# EAGLE design ArduPilotMega_v141 (EAGLE 5.10)
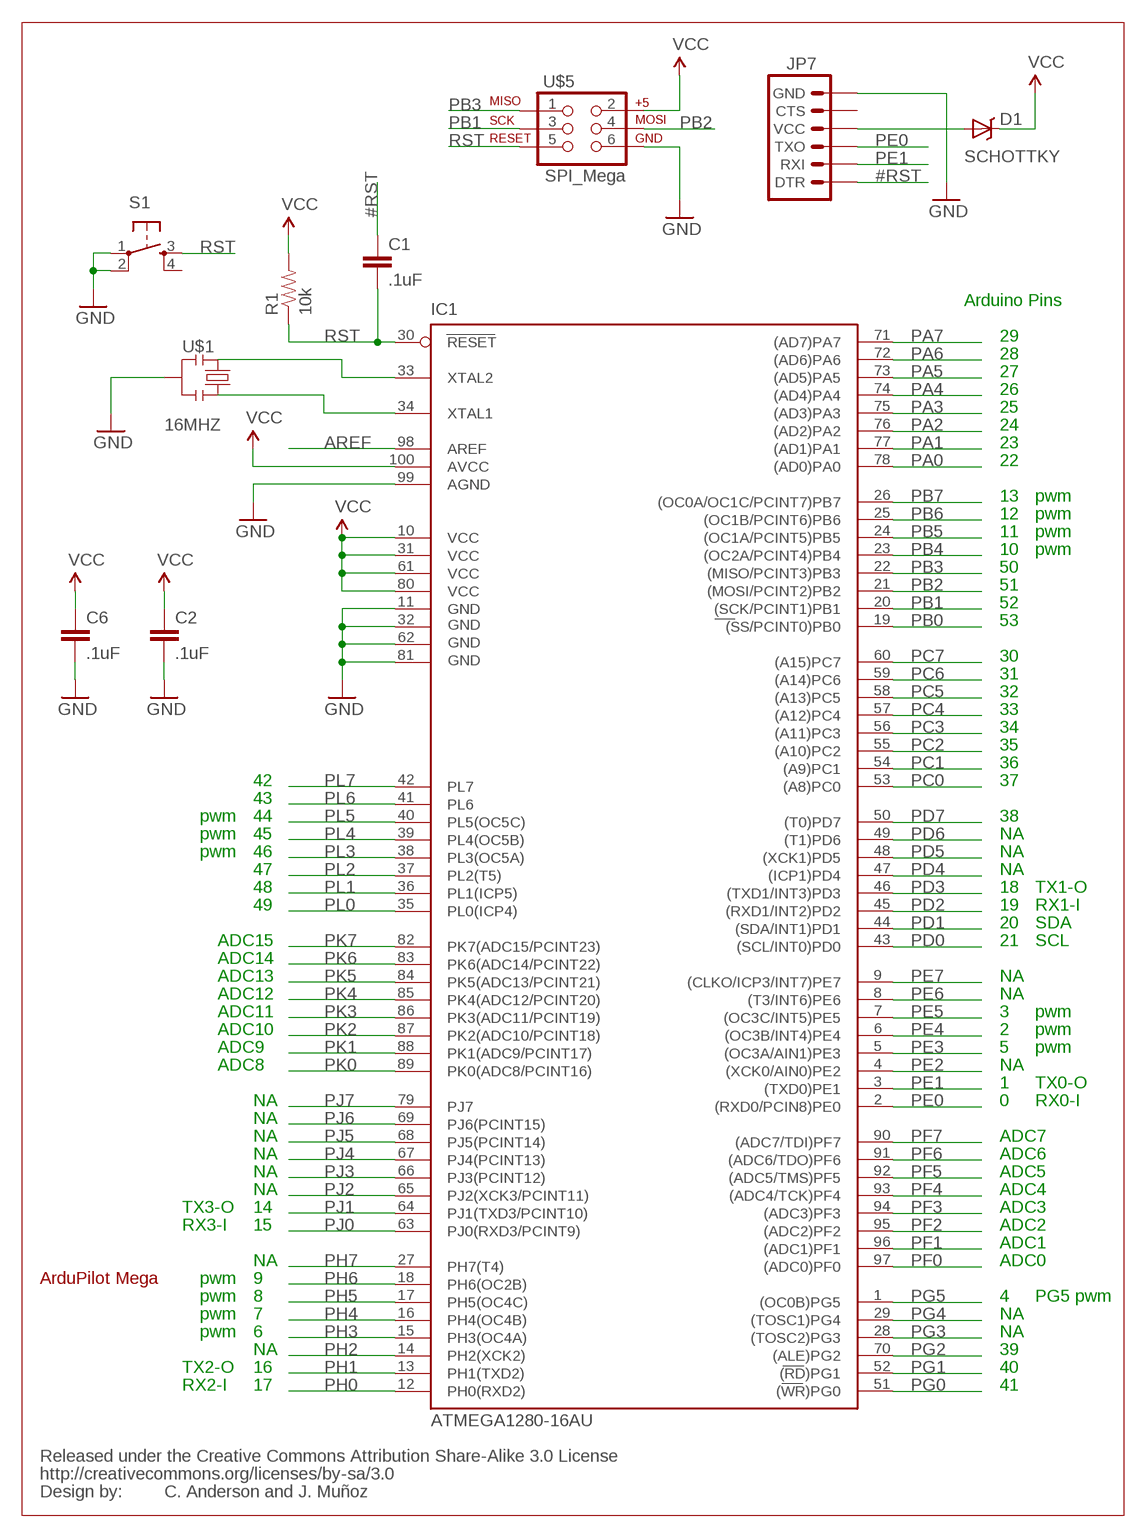
[diagram p0: schematic, sheet 1, part 1 of 2]
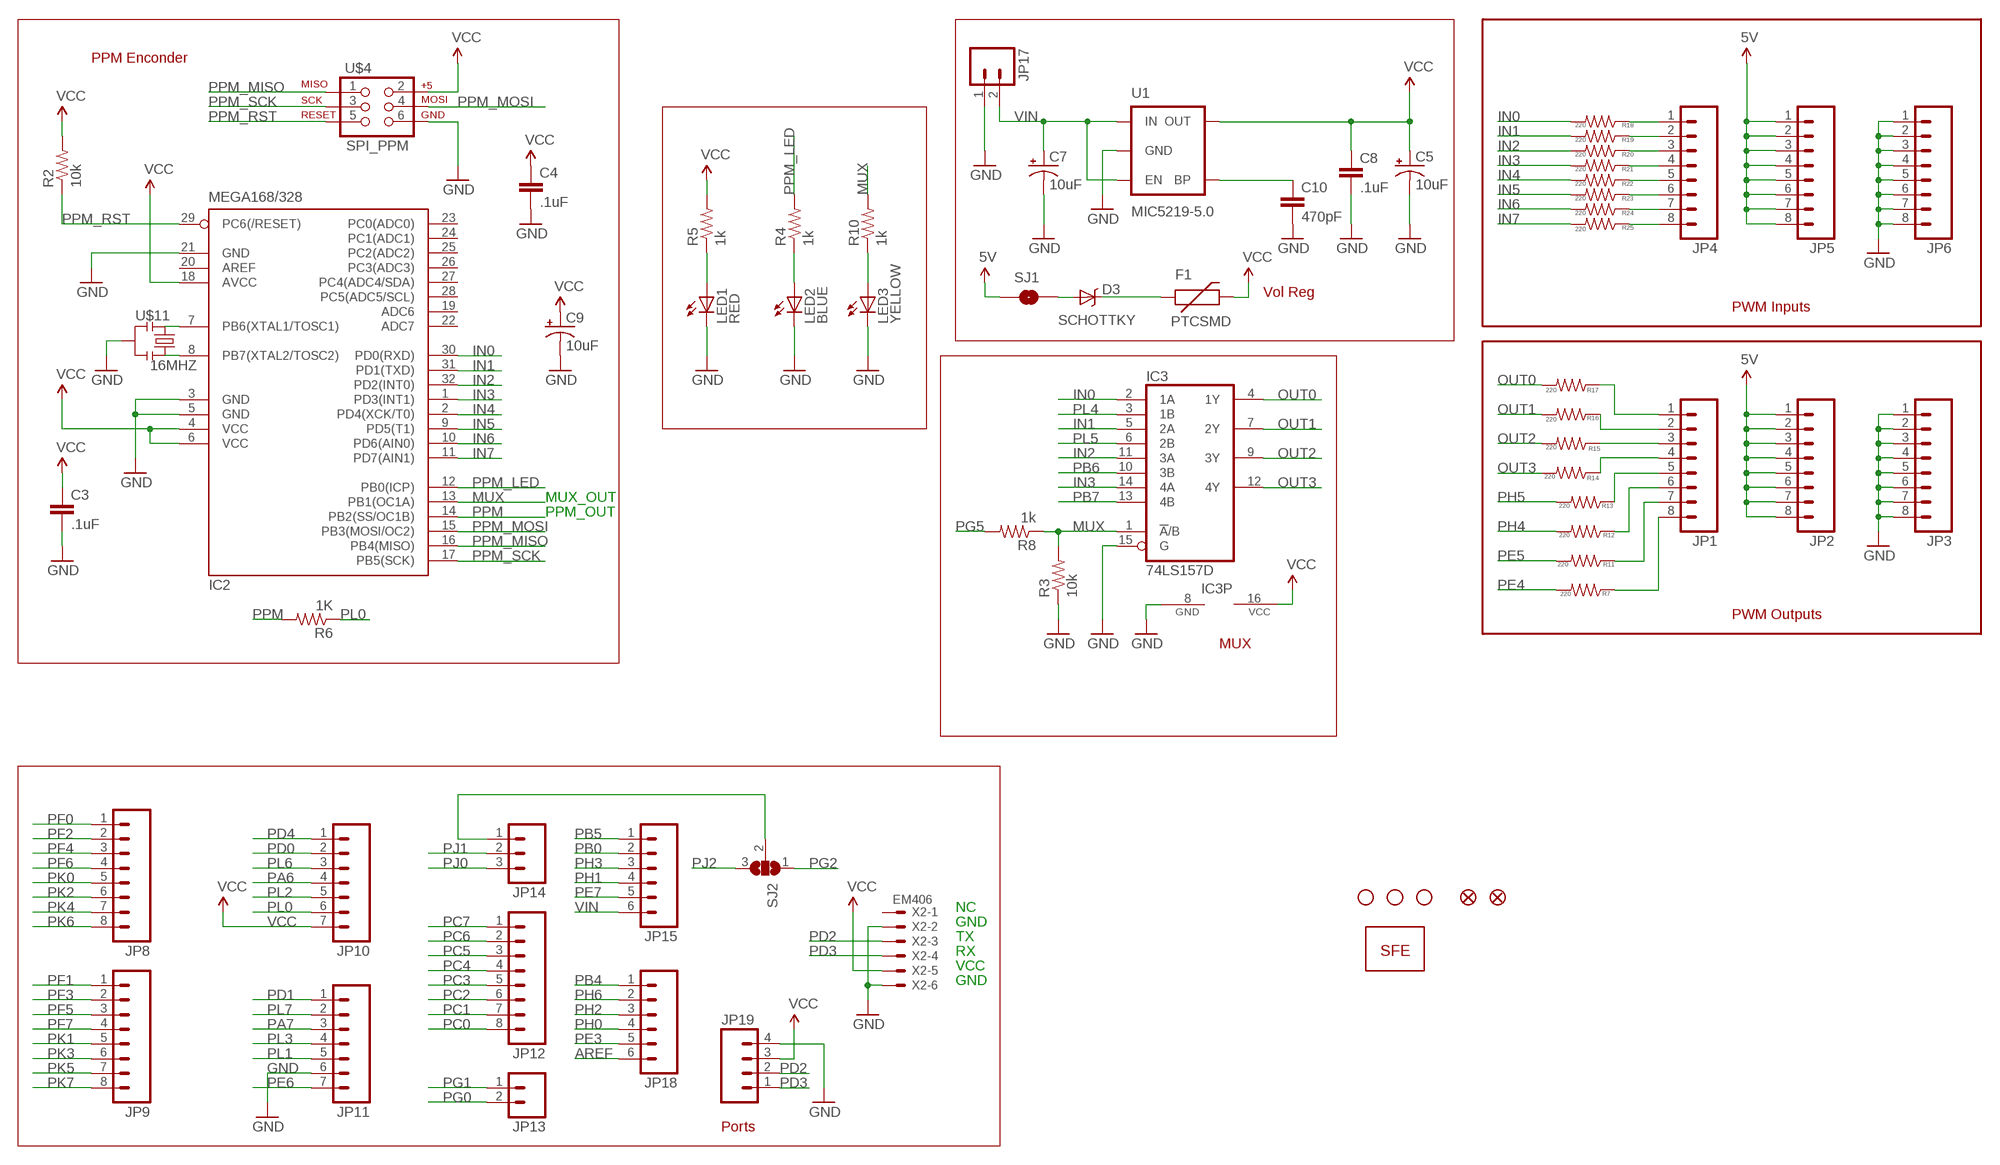
[diagram p1: schematic, sheet 1, part 2 of 2]

## Parts
C1  .1uF  CAP0402  [C0402]
C2  .1uF  CAP0402  [C0402]
C3  .1uF  CAP0402  [C0402]
C4  .1uF  CAP0402  [C0402]
C5  10uF  CAP_POL1206  [EIA3216]
C6  .1uF  CAP0402  [C0402]
C7  10uF  CAP_POL1206  [EIA3216]
C8  .1uF  CAP0402  [C0402]
C9  10uF  CAP_POL1206  [EIA3216]
C10  470pF  CAP0402  [C0402]
D1  SCHOTTKY  DIODE-SCHOTTKY_  [SMA-DIODE]
D3  SCHOTTKY  DIODE-SCHOTTKY_  [SMA-DIODE]
F1  PTCSMD  [PTC-1206]
IC1  ATMEGA1280-16AU  [TQFP100]
IC2  MEGA168/328  MEGA8-AI  [TQFP32-08]
IC3  74LS157D  [SO16]
JP1  M08  [1X08]
JP2  M08  [1X08]
JP3  M08  [1X08]
JP4  M08  [1X08]
JP5  M08  [1X08]
JP6  M08  [1X08]
JP7  ARDUINO_SERIAL_PROGRAMPTH  [1X06]
JP8  M08  [1X08]
JP9  M08  [1X08]
JP10  M07  [1X07]
JP11  M07  [1X07]
JP12  M08  [1X08]
JP13  M02PTH  [1X02]
JP14  M03PTH  [1X03]
JP15  M06SIP  [1X06]
JP16  FIDUCIAL1X2  [FIDUCIAL-1X2]
JP17  M02NG  [1X02]
JP18  M06SIP  [1X06]
JP19  M04PTH  [1X04]
JP20  FIDUCIAL1X2  [FIDUCIAL-1X2]
LED1  RED  LED0603  [LED-0603]
LED2  BLUE  LED0603  [LED-0603]
LED3  YELLOW  LED0603  [LED-0603]
R1  10k  RESISTOR0402  [C0402]
R2  10k  RESISTOR0402  [C0402]
R3  10k  RESISTOR0402  [C0402]
R4  1k  RESISTOR0402  [C0402]
R5  1k  RESISTOR0402  [C0402]
R6  1K  RESISTOR0402  [C0402]
R7  220  RESISTOR0402  [C0402]
R8  1k  RESISTOR0402  [C0402]
R10  1k  RESISTOR0402  [C0402]
R11  220  RESISTOR0402  [C0402]
R12  220  RESISTOR0402  [C0402]
R13  220  RESISTOR0402  [C0402]
R14  220  RESISTOR0402  [C0402]
R15  220  RESISTOR0402  [C0402]
R16  220  RESISTOR0402  [C0402]
R17  220  RESISTOR0402  [C0402]
R18  220  RESISTOR0402  [C0402]
R19  220  RESISTOR0402  [C0402]
R20  220  RESISTOR0402  [C0402]
R21  220  RESISTOR0402  [C0402]
R22  220  RESISTOR0402  [C0402]
R23  220  RESISTOR0402  [C0402]
R24  220  RESISTOR0402  [C0402]
R25  220  RESISTOR0402  [C0402]
S1  TAC_SWITCHSMD  [TACTILE_SWITCH_SMD]
SJ1  SJ2  SOLDERJUMPERNC  [SJ_2S]
SJ2  SOLDERJUMPER_2WAYS  [SJ_3]
U1  MIC5219-5.0  V_REG_LDOSMD  [SOT23-5]
U$1  16MHZ  RESONATORSMD  [RESONATOR-SMD]
U$4  SPI_PPM  AVR_SPI_PRG_6NS  [2X3-NS]
U$5  SPI_Mega  AVR_SPI_PRG_6NS  [2X3-NS]
U$7  LOGO-SFENEW  [SFE-NEW-WEBLOGO]
U$8  CREATIVE_COMMONS  [CREATIVE_COMMONS]
U$10  STAND-OFF  [STAND-OFF]
U$11  16MHZ  RESONATORSMD  [RESONATOR-SMD]
U$12  STAND-OFF  [STAND-OFF]
U$13  STAND-OFF  [STAND-OFF]
X2  EM406  SM06B-SRSS-TB  [SM06B-SRSS-TB]

## Nets
5V: JP2.1 JP2.2 JP2.3 JP2.4 JP2.5 JP2.6 JP2.7 JP2.8 JP5.1 JP5.2 JP5.3 JP5.4 JP5.5 JP5.6 JP5.7 JP5.8 SJ1.1
#RST: C1.1 JP7.1(DTR)
AREF: IC1.98(AREF) JP18.6
GND: C2.2 C3.2 C4.2 C5.C(-) C6.2 C7.C(-) C8.2 C9.C(-) C10.2 IC1.11(GND) IC1.32(GND1) IC1.62(GND2) IC1.81(GND3) IC1.99(AGND) IC2.3(GND) IC2.5(GND) IC2.21(GND) IC3.8(GND) IC3.15(G) JP3.1 JP3.2 JP3.3 JP3.4 JP3.5 JP3.6 JP3.7 JP3.8 JP6.1 JP6.2 JP6.3 JP6.4 JP6.5 JP6.6 JP6.7 JP6.8 JP7.6(GND) JP11.6 JP17.1 JP19.4 LED1.C LED2.C LED3.C R3.1 S1.1 S1.2 U1.2(GND) U$1.2 U$4.6 U$5.6 U$11.2 X2.2 X2.6
IN0: IC2.30(PD0(RXD)) IC3.2(1A) R18.2
IN1: IC2.31(PD1(TXD)) IC3.5(2A) R19.2
IN2: IC2.32(PD2(INT0)) IC3.11(3A) R20.2
IN3: IC2.1(PD3(INT1)) IC3.14(4A) R21.2
IN4: IC2.2(PD4(XCK/T0)) R22.2
IN5: IC2.9(PD5(T1)) R23.2
IN6: IC2.10(PD6(AIN0)) R24.2
IN7: IC2.11(PD7(AIN1)) R25.2
MUX: IC2.13(PB1(OC1A)) IC3.1(!A!/B) R3.2 R8.1 R10.2
N$1: LED1.A R5.1
N$2: LED2.A R4.1
N$3: C10.1 U1.4(BP)
N$5: LED3.A R10.1
N$6: IC2.7(PB6(XTAL1/TOSC1)) U$11.1
N$7: IC2.8(PB7(XTAL2/TOSC2)) U$11.3
N$8: JP1.5 R13.1
N$9: JP1.6 R12.1
N$10: JP1.7 R11.1
N$11: JP1.8 R7.1
N$12: JP14.1 SJ2.2
N$13: JP1.4 R14.1
N$14: JP1.3 R15.1
N$15: JP1.2 R16.1
N$16: JP1.1 R17.1
N$17: D3.A SJ1.2
N$18: JP4.1 R18.1
N$19: JP4.2 R19.1
N$20: JP4.3 R20.1
N$21: JP4.4 R21.1
N$22: JP4.5 R22.1
N$23: JP4.6 R23.1
N$24: JP4.7 R24.1
N$25: JP4.8 R25.1
N$26: D3.C F1.1
N$27: D1.A JP7.4(VCC)
N$56: IC1.34(XTAL1) U$1.3
N$89: IC1.33(XTAL2) U$1.1
OUT0: IC3.4(1Y) R17.2
OUT1: IC3.7(2Y) R16.2
OUT2: IC3.9(3Y) R15.2
OUT3: IC3.12(4Y) R14.2
PA0: IC1.78((AD0)PA0)
PA1: IC1.77((AD1)PA1)
PA2: IC1.76((AD2)PA2)
PA3: IC1.75((AD3)PA3)
PA4: IC1.74((AD4)PA4)
PA5: IC1.73((AD5)PA5)
PA6: IC1.72((AD6)PA6) JP10.4
PA7: IC1.71((AD7)PA7) JP11.3
PB0: IC1.19((SS/PCINT0)PB0) JP15.2
PB1: IC1.20((SCK/PCINT1)PB1) U$5.3
PB2: IC1.21((MOSI/PCINT2)PB2) U$5.4
PB3: IC1.22((MISO/PCINT3)PB3) U$5.1
PB4: IC1.23((OC2A/PCINT4)PB4) JP18.1
PB5: IC1.24((OC1A/PCINT5)PB5) JP15.1
PB6: IC1.25((OC1B/PCINT6)PB6) IC3.10(3B)
PB7: IC1.26((OC0A/OC1C/PCINT7)PB7) IC3.13(4B)
PC0: IC1.53((A8)PC0) JP12.8
PC1: IC1.54((A9)PC1) JP12.7
PC2: IC1.55((A10)PC2) JP12.6
PC3: IC1.56((A11)PC3) JP12.5
PC4: IC1.57((A12)PC4) JP12.4
PC5: IC1.58((A13)PC5) JP12.3
PC6: IC1.59((A14)PC6) JP12.2
PC7: IC1.60((A15)PC7) JP12.1
PD0: IC1.43((SCL/INT0)PD0) JP10.2
PD1: IC1.44((SDA/INT1)PD1) JP11.1
PD2: IC1.45((RXD1/INT2)PD2) JP19.2 X2.3
PD3: IC1.46((TXD1/INT3)PD3) JP19.1 X2.4
PD4: IC1.47((ICP1)PD4) JP10.1
PD5: IC1.48((XCK1)PD5)
PD6: IC1.49((T1)PD6)
PD7: IC1.50((T0)PD7)
PE0: IC1.2((RXD0/PCIN8)PE0) JP7.3(TXO)
PE1: IC1.3((TXD0)PE1) JP7.2(RXI)
PE2: IC1.4((XCK0/AIN0)PE2)
PE3: IC1.5((OC3A/AIN1)PE3) JP18.5
PE4: IC1.6((OC3B/INT4)PE4) R7.2
PE5: IC1.7((OC3C/INT5)PE5) R11.2
PE6: IC1.8((T3/INT6)PE6) JP11.7
PE7: IC1.9((CLKO/ICP3/INT7)PE7) JP15.5
PF0: IC1.97((ADC0)PF0) JP8.1
PF1: IC1.96((ADC1)PF1) JP9.1
PF2: IC1.95((ADC2)PF2) JP8.2
PF3: IC1.94((ADC3)PF3) JP9.2
PF4: IC1.93((ADC4/TCK)PF4) JP8.3
PF5: IC1.92((ADC5/TMS)PF5) JP9.3
PF6: IC1.91((ADC6/TDO)PF6) JP8.4
PF7: IC1.90((ADC7/TDI)PF7) JP9.4
PG0: IC1.51((WR)PG0) JP13.2
PG1: IC1.52((RD)PG1) JP13.1
PG2: IC1.70((ALE)PG2) SJ2.1
PG3: IC1.28((TOSC2)PG3)
PG4: IC1.29((TOSC1)PG4)
PG5: IC1.1((OC0B)PG5) R8.2
PH0: IC1.12(PH0(RXD2)) JP18.4
PH1: IC1.13(PH1(TXD2)) JP15.4
PH2: IC1.14(PH2(XCK2)) JP18.3
PH3: IC1.15(PH3(OC4A)) JP15.3
PH4: IC1.16(PH4(OC4B)) R12.2
PH5: IC1.17(PH5(OC4C)) R13.2
PH6: IC1.18(PH6(OC2B)) JP18.2
PH7: IC1.27(PH7(T4))
PJ0: IC1.63(PJ0(RXD3/PCINT9)) JP14.3
PJ1: IC1.64(PJ1(TXD3/PCINT10)) JP14.2
PJ2: IC1.65(PJ2(XCK3/PCINT11)) SJ2.3
PJ3: IC1.66(PJ3(PCINT12))
PJ4: IC1.67(PJ4(PCINT13))
PJ5: IC1.68(PJ5(PCINT14))
PJ6: IC1.69(PJ6(PCINT15))
PJ7: IC1.79(PJ7)
PK0: IC1.89(PK0(ADC8/PCINT16)) JP8.5
PK1: IC1.88(PK1(ADC9/PCINT17)) JP9.5
PK2: IC1.87(PK2(ADC10/PCINT18)) JP8.6
PK3: IC1.86(PK3(ADC11/PCINT19)) JP9.6
PK4: IC1.85(PK4(ADC12/PCINT20)) JP8.7
PK5: IC1.84(PK5(ADC13/PCINT21)) JP9.7
PK6: IC1.83(PK6(ADC14/PCINT22)) JP8.8
PK7: IC1.82(PK7(ADC15/PCINT23)) JP9.8
PL0: IC1.35(PL0(ICP4)) JP10.6 R6.1
PL1: IC1.36(PL1(ICP5)) JP11.5
PL2: IC1.37(PL2(T5)) JP10.5
PL3: IC1.38(PL3(OC5A)) JP11.4
PL4: IC1.39(PL4(OC5B)) IC3.3(1B)
PL5: IC1.40(PL5(OC5C)) IC3.6(2B)
PL6: IC1.41(PL6) JP10.3
PL7: IC1.42(PL7) JP11.2
PPM: IC2.14(PB2(SS/OC1B)) R6.2
PPM_LED: IC2.12(PB0(ICP)) R4.2
PPM_MISO: IC2.16(PB4(MISO)) U$4.1
PPM_MOSI: IC2.15(PB3(MOSI/OC2)) U$4.4
PPM_RST: IC2.29(PC6(/RESET)) R2.1 U$4.5
PPM_SCK: IC2.17(PB5(SCK)) U$4.3
RST: C1.2 IC1.30(RESET) R1.1 S1.3 U$5.5
VCC: C2.1 C3.1 C4.1 C5.A(+) C6.1 C8.1 C9.A(+) D1.C F1.2 IC1.10(VCC) IC1.31(VCC1) IC1.61(VCC2) IC1.80(VCC3) IC1.100(AVCC) IC2.4(VCC) IC2.6(VCC) IC2.18(AVCC) IC3.16(VCC) JP10.7 JP19.3 R1.2 R2.2 R5.2 U1.5(OUT) U$4.2 U$5.2 X2.5
VIN: C7.A(+) JP15.6 JP17.2 U1.1(IN) U1.3(EN)
Unconnected: IC2.19(ADC6) IC2.20(AREF) IC2.22(ADC7) IC2.23(PC0(ADC0)) IC2.24(PC1(ADC1)) IC2.25(PC2(ADC2)) IC2.26(PC3(ADC3)) IC2.27(PC4(ADC4/SDA)) IC2.28(PC5(ADC5/SCL)) JP7.5(CTS) S1.4 X2.1

## Notes on the sheet
- PPM Enconder
- Arduino Pins
- 29
- 28 | Vol Reg
- 27 | PWM Inputs
- 26
- 25
- 24
- 23
- 22
- 13 | pwm
- 12 | pwm
- 11 | pwm
- 10 | pwm
- 50
- 51
- 52 | MUX_OUT
- 53 | PPM_OUT
- 30
- 31
- 32
- 33
- 34
- 35 | PWM Outputs
- 36
- 42 | 37 | MUX
- 43
- pwm | 44 | 38
- pwm | 45 | NA
- pwm | 46 | NA
- 47 | NA
- 48 | 18 | TX1-O
- 49 | 19 | RX1-I
- 20 | SDA
- ADC15 | 21 | SCL
- ADC14
- ADC13 | NA
- ADC12 | NA
- ADC11 | 3 | pwm
- ADC10 | 2 | pwm
- ADC9 | 5 | pwm
- ADC8 | NA
- 1 | TX0-O
- NA | 0 | RX0-I | NC
- NA | GND
- NA | ADC7 | TX
- NA | ADC6 | RX
- NA | ADC5 | VCC
- NA | ADC4 | GND
- TX3-O | 14 | ADC3
- RX3-I | 15 | ADC2
- ADC1
- NA | ADC0
- ArduPilot Mega | pwm | 9
- pwm | 8 | 4 | PG5 pwm
- pwm | 7 | NA
- pwm | 6 | NA
- NA | 39
- TX2-O | 16 | 40 | Ports
- RX2-I | 17 | 41
- C. Anderson and J. Muñoz

## Library data of the parts
C1-C4 C6 C8 C10 = DIYdrones3:CAP: Capacitor Standard 0603 ceramic capacitor, and 0.1" leaded capacitor.
C5 C7 C9 = DIYdrones3:CAP_POL: Capacitor Polarized These are standard SMD and PTH capacitors. Normally 10uF, 47uF, and 100uF in electrolytic and tantalum varieties. Always verify the external diameter of the through hole cap, it varies with capacity, voltage, and manufacturer. The EIA devices should be standard.
D1 D3 = SparkFun:DIODE-SCHOTTKY
F1 = SparkFun:PTC: Resettable Fuse PTC Resettable Fuse. Spark Fun Electronics SKU : COM-08357
IC1 = atmel-2010:ATMEGA*: MICROCONTROLLER 64/128/256 Kbytes FLASH 4 Kbytes EEPROM 8 Kbytes SRAM 86 General Purpose I/O pins 12-channels16-bit PWM 4 x Serial USARTs 16-channels 10-bit A/D
IC2 = atmel:MEGA8: MICROCONTROLLER 8 Kbytes FLASH, 1 kbytes SRAM, 512 bytes EEPROM, USART, 6-channel 10 bit ADC, 2-channel 8 bit ADC Pin compatible with Atmega48, ATMega88, ATMega168 Source: avr.lbr
IC3 = 74xx-us:74*157: Quadruple 2-line to 1-line data SELECTOR/MULTIPLEXER
JP1-JP6 JP8 JP9 JP12 = SparkFunv2:M08: Header 8 Standard 8-pin 0.1" header. Use with straight break away headers (SKU : PRT-00116), right angle break away headers (PRT-00553), swiss pins (PRT-00743), machine pins (PRT-00117), and female headers (PRT-00115).
JP7 = SparkFunv2:ARDUINO_SERIAL_PROGRAM
JP10 JP11 = SparkFunv2:M07: Header 7 Standard 7-pin 0.1" header. Use with straight break away headers (SKU : PRT-00116), right angle break away headers (PRT-00553), swiss pins (PRT-00743), machine pins (PRT-00117), and female headers (PRT-00115). NOTES ON THE VARIANTS LOCK and LOCK_LONGPADS... This footprint was designed to help hold the alignment of a through-hole component (i.e. 7-pin header) while soldering it into place. You may notice that each hole has been shifted either up or down by 0.005 of an inch from it's more standard position (which is usually a perfectly straight line). This slight alteration caused the pins (the squares in the middle) to touch the edges of the holes. Because they are alternating, it causes a "brace" to hold the header in place. 0.005 has proven to be the perfect amount of "off-center" position when using our standard breakaway headers. Although looks a little odd when you look at the bare footprint, once you have a header in there, the alteration is very hard to notice. Also, if you push a header all the way into place, it is covered up entirely on the bottom side. This idea of altering the position of holes to aid alignment will be further integrated into the Sparkfun Library for other footprints. It can help hold any component with 3 or more connection pins.
JP13 = SparkFunv2:M02: Header 2 Standard 2-pin 0.1" header. Use with straight break away headers (SKU : PRT-00116), right angle break away headers (PRT-00553), swiss pins (PRT-00743), machine pins (PRT-00117), and female headers (PRT-00115). Molex polarized connector foot print use with SKU : PRT-08233 with associated crimp pins and housings.
JP14 = SparkFunv2:M03: Header 3 Standard 3-pin 0.1" header. Use with straight break away headers (SKU : PRT-00116), right angle break away headers (PRT-00553), swiss pins (PRT-00743), machine pins (PRT-00117), and female headers (PRT-00115). Molex polarized connector foot print use with SKU : PRT-08232 with associated crimp pins and housings.
JP15 JP18 = SparkFunv2:M06: Header 6 Standard 6-pin 0.1" header. Use with straight break away headers (SKU : PRT-00116), right angle break away headers (PRT-00553), swiss pins (PRT-00743), machine pins (PRT-00117), and female headers (PRT-00115). Molex polarized connector foot print use with SKU : PRT-08094 with associated crimp pins and housings. NOTES ON THE VARIANTS LOCK and LOCK_LONGPADS... This footprint was designed to help hold the alignment of a through-hole component (i.e. 6-pin header) while soldering it into place. You may notice that each hole has been shifted either up or down by 0.005 of an inch from it's more standard position (which is a perfectly straight line). This slight alteration caused the pins (the squares in the middle) to touch the edges of the holes. Because they are alternating, it causes a "brace" to hold the component in place. 0.005 has proven to be the perfect amount of "off-center" position when using our standard breakaway headers. Although looks a little odd when you look at the bare footprint, once you have a header in there, the alteration is very hard to notice. Also, if you push a header all the way into place, it is covered up entirely on the bottom side. This idea of altering the position of holes to aid alignment will be further integrated into the Sparkfun Library for other footprints. It can help hold any component with 3 or more connection pins.
JP16 JP20 = SparkFun:FIDUCIAL: Fiducial Alignment Points Various fiducial points for machine vision alignment.
JP17 = SparkFunv2:M02NG
JP19 = SparkFunv2:M04: Header 4 Standard 4-pin 0.1" header. Use with straight break away headers (SKU : PRT-00116), right angle break away headers (PRT-00553), swiss pins (PRT-00743), machine pins (PRT-00117), and female headers (PRT-00115). Molex polarized connector foot print use with SKU : PRT-08231 with associated crimp pins and housings.
LED1-LED3 = DIYdrones3:LED: LEDs Standard schematic elements and footprints for 5mm, 3mm, 1206, and 0603 sized LEDs. 5mm - Spark Fun Electronics SKU : COM-00529 (and others)
R1-R8 R10-R25 = DIYdrones3:RESISTOR: Resistor Basic schematic elements and footprints for 0603, 1206, and PTH 1/10th watt (small) resistors.
S1 = DIYdrones3:TAC_SWITCH: Momentary Switch Button commonly used for reset or general input. Spark Fun Electronics SKU : COM-00097
SJ1 = SparkFun:SOLDERJUMPER: Solder Jumper Standard SMD solder jumper. Used to automate production. Two varients : Normally Open and Normally Closed are the same, but have different paste layers. NC will have a large amount of paste and should jumper during reflow.
SJ2 = DIYdrones3:SOLDERJUMPER_2WAY: Solder Jumper 2 way solder jumper
U1 = SparkFun:V_REG_LDO: Voltage Regulator LDO Standard 150mA LDO voltage regulator in SOT-23 layout. Micrel part MIC5205. BP (by-pass) pin is used to lower output noise with 470pF cap.
U$1 U$11 = DIYdrones3:RESONATOR: Resonator Small SMD resonator. This is the itty bitty 10/20MHz resonators with built in caps. CSTCE10M0G55 and CSTCE20M0V53. Footprint has been reviewed closely but hasn't been tested yet.
U$4 U$5 = SparkFunv2:AVR_SPI_PRG_6: AVR ISP 6 Pin This is the reduced ISP connector for AVR programming. Common on Arduino. This footprint will take up less PCB space and can be used with a 10-pin to 6-pin adapter such as SKU: BOB-08508
U$7 = DIYdrones3:LOGO-SFE: Spark Fun Electronics PCB Logo This is the standard Spark Fun Electronics PCB logo.
U$8 = SparkFun:CREATIVE_COMMONS
U$10 U$12 U$13 = DIYdrones3:STAND-OFF: Stand Off This is the mechanical footprint for a #4 phillips button head screw. Use the keepout ring to avoid running the screw head into surrounding components. SKU : PRT-00447
X2 = con-jst2:?M06B-SRSS-TB: Disconnectable Crimp style connector, 1.0mm pitch 6 contacts

## Board
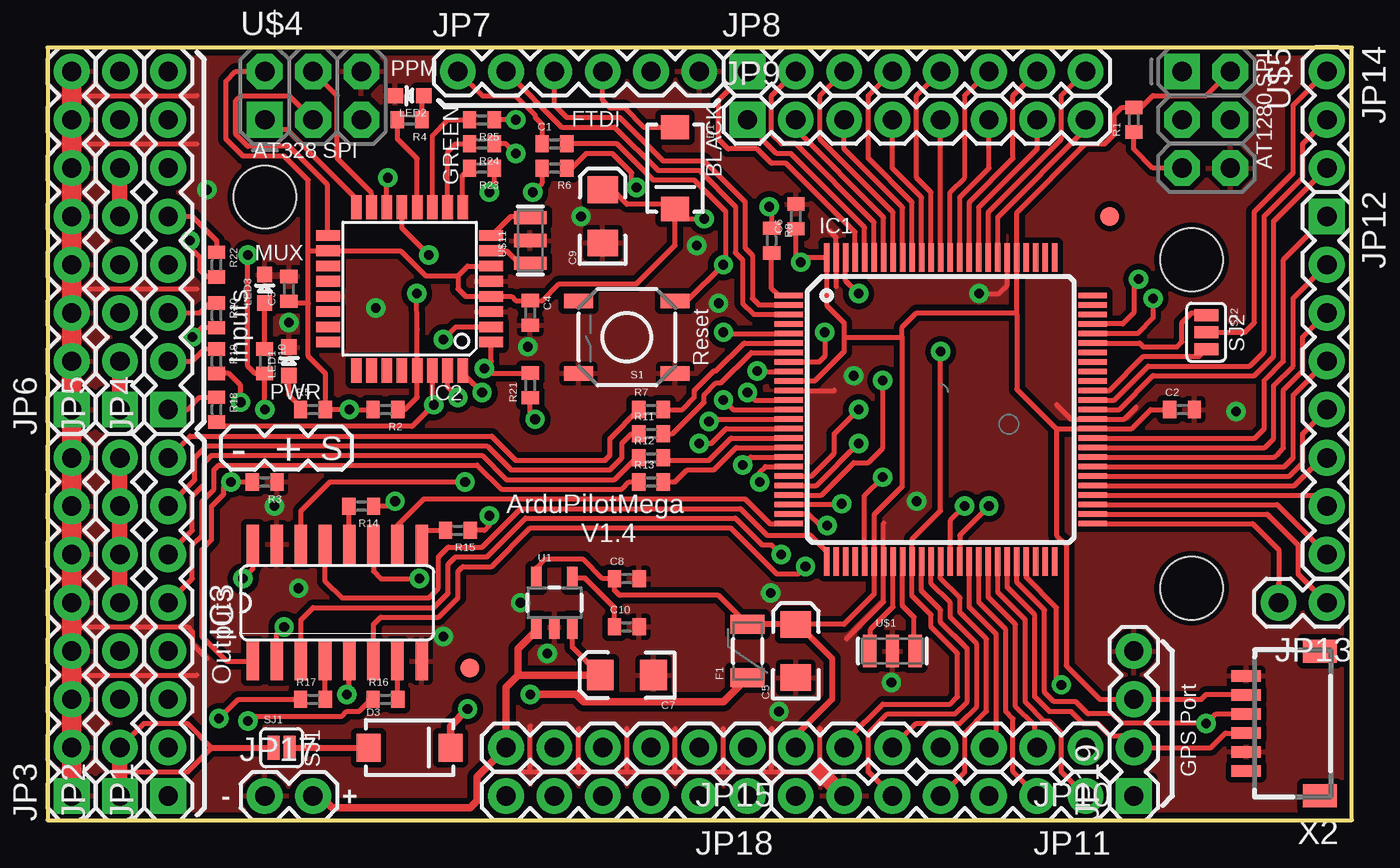
[diagram p2: board, top side]
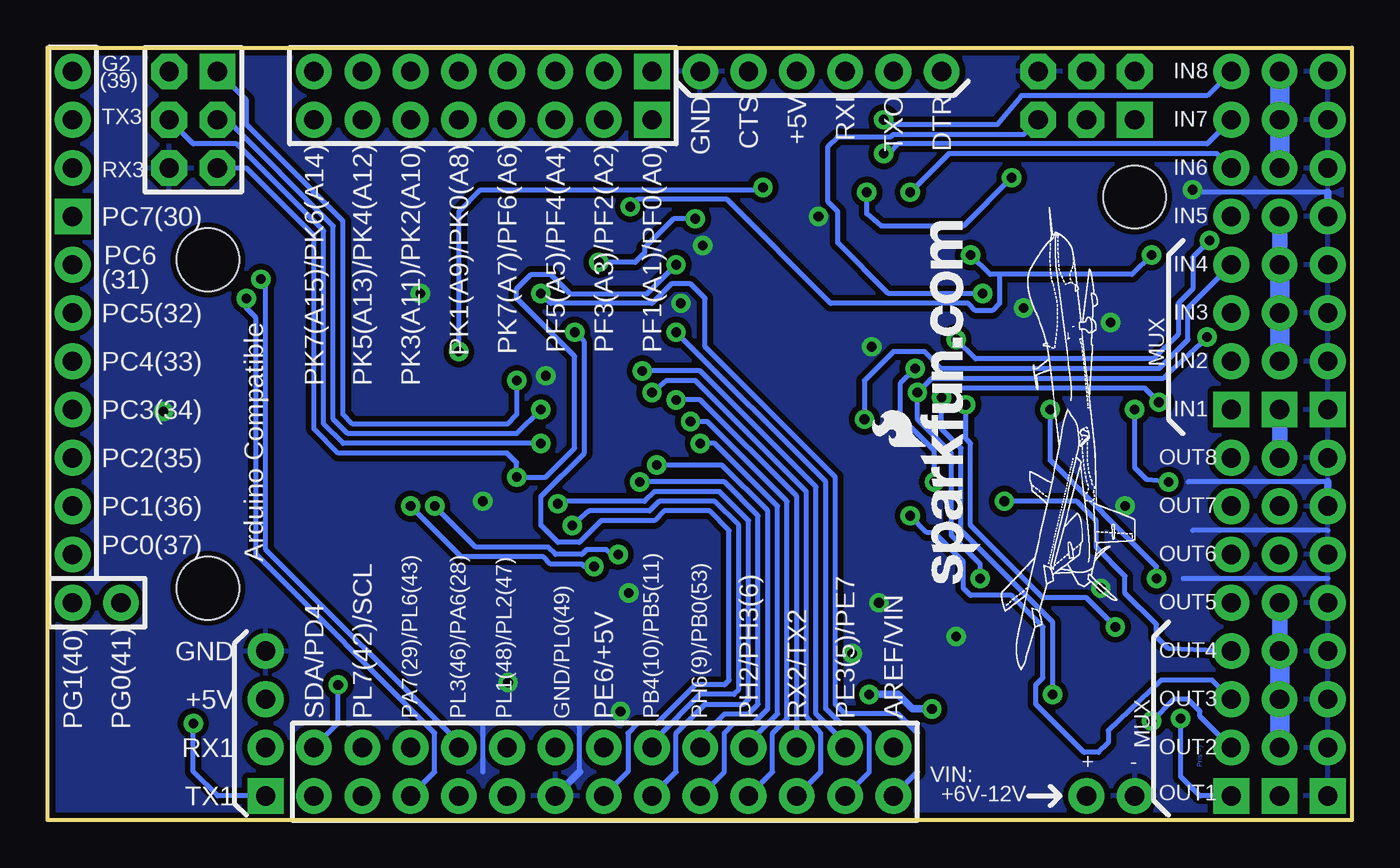
[diagram p3: board, bottom side, seen from below]

Size 68.63 x 40.63 mm. Coordinates in mm from the lower left corner, seen from the top.
Outline: 0,0 68.63,0 68.63,40.63 0,40.63 0,0
Copper layers (1*16): Top 0.035mm / dielectric 1.5mm / Bottom 0.035mm
Design rules "SparkFun": minimum track width 8mil, minimum drill 20mil, track to track 8mil, track to pad 8mil, pad to pad 8mil, via to via 8mil, smd to smd 8mil, copper to edge 10mil, drill to drill 8mil, minimum pad ring 12mil, minimum via ring 10mil, stop-mask expansion 4mil, vias tented up to drill 25mil, thermal gap 10mil

### Footprints (pad centres in the part's own frame; a part is rotated, then mirrored left to right if it is on the bottom)
C0402 = smd 0.7 x 0.9: 1 -0.65,0; 2 0.65,0
EIA3216 = smd 1.4 x 1.6: A 1.4,0; C -1.4,0
SMA-DIODE = smd 1.27 x 1.47: A -2.15,0; C 2.15,0
PTC-1206 = smd 1 x 1.8: 1 -1.4,0; 2 1.4,0
TQFP100 = smd 1.5 x 0.3: 1 -8,6; 2 -8,5.5; 3 -8,5; 4 -8,4.5; 5 -8,4; 6 -8,3.5; 7 -8,3; 8 -8,2.5; 9 -8,2; 10 -8,1.5; 11 -8,1; 12 -8,0.5; 13 -8,0; 14 -8,-0.5; 15 -8,-1; 16 -8,-1.5; 17 -8,-2; 18 -8,-2.5; 19 -8,-3; 20 -8,-3.5; 21 -8,-4; 22 -8,-4.5; 23 -8,-5; 24 -8,-5.5; 25 -8,-6; 51 8,-6; 52 8,-5.5; 53 8,-5; 54 8,-4.5; 55 8,-4; 56 8,-3.5; 57 8,-3; 58 8,-2.5; 59 8,-2; 60 8,-1.5; 61 8,-1; 62 8,-0.5; 63 8,0; 64 8,0.5; 65 8,1; 66 8,1.5; 67 8,2; 68 8,2.5; 69 8,3; 70 8,3.5; 71 8,4; 72 8,4.5; 73 8,5; 74 8,5.5; 75 8,6 | smd 0.3 x 1.5: 26 -6,-8; 27 -5.5,-8; 28 -5,-8; 29 -4.5,-8; 30 -4,-8; 31 -3.5,-8; 32 -3,-8; 33 -2.5,-8; 34 -2,-8; 35 -1.5,-8; 36 -1,-8; 37 -0.5,-8; 38 0,-8; 39 0.5,-8; 40 1,-8; 41 1.5,-8; 42 2,-8; 43 2.5,-8; 44 3,-8; 45 3.5,-8; 46 4,-8; 47 4.5,-8; 48 5,-8; 49 5.5,-8; 50 6,-8; 76 6,8; 77 5.5,8; 78 5,8; 79 4.5,8; 80 4,8; 81 3.5,8; 82 3,8; 83 2.5,8; 84 2,8; 85 1.5,8; 86 1,8; 87 0.5,8; 88 0,8; 89 -0.5,8; 90 -1,8; 91 -1.5,8; 92 -2,8; 93 -2.5,8; 94 -3,8; 95 -3.5,8; 96 -4,8; 97 -4.5,8; 98 -5,8; 99 -5.5,8; 100 -6,8
TQFP32-08@1 = smd 1.27 x 0.559: 1 -4.293,2.8; 2 -4.293,2; 3 -4.293,1.2; 4 -4.293,0.4; 5 -4.293,-0.4; 6 -4.293,-1.2; 7 -4.293,-2; 8 -4.293,-2.8; 17 4.293,-2.8; 18 4.293,-2; 19 4.293,-1.2; 20 4.293,-0.4; 21 4.293,0.4; 22 4.293,1.2; 23 4.293,2; 24 4.293,2.8 | smd 0.559 x 1.27: 9 -2.8,-4.293; 10 -2,-4.293; 11 -1.2,-4.293; 12 -0.4,-4.293; 13 0.4,-4.293; 14 1.2,-4.293; 15 2,-4.293; 16 2.8,-4.293; 25 2.8,4.293; 26 2,4.293; 27 1.2,4.293; 28 0.4,4.293; 29 -0.4,4.293; 30 -1.2,4.293; 31 -2,4.293; 32 -2.8,4.293
SO16 = smd 0.66 x 2.032: 1 -4.445,-3.073; 2 -3.175,-3.073; 3 -1.905,-3.073; 4 -0.635,-3.073; 5 0.635,-3.073; 6 1.905,-3.073; 7 3.175,-3.073; 8 4.445,-3.073; 9 4.445,3.073; 10 3.175,3.073; 11 1.905,3.073; 12 0.635,3.073; 13 -0.635,3.073; 14 -1.905,3.073; 15 -3.175,3.073; 16 -4.445,3.073
1X08 = drill 1.016 pad 1.88 square: 1 0,0 | drill 1.016 pad 1.88 round: 2 2.54,0; 3 5.08,0; 4 7.62,0; 5 10.16,0; 6 12.7,0; 7 15.24,0; 8 17.78,0
1X06 = drill 1.016 pad 1.88 round: 1 0,0; 2 2.54,0; 3 5.08,0; 4 7.62,0; 5 10.16,0; 6 12.7,0
1X07 = drill 1.016 pad 1.88 round: 1 0,0; 2 2.54,0; 3 5.08,0; 4 7.62,0; 5 10.16,0; 6 12.7,0; 7 15.24,0
1X02 = drill 1.016 pad 1.88 round: 1 0,0; 2 2.54,0
1X03 = drill 1.016 pad 1.88 round: 1 0,0; 2 2.54,0; 3 5.08,0
FIDUCIAL-1X2 = smd 1 x 1: 1 0,0
1X04 = drill 1.016 pad 1.88 square: 1 0,0 | drill 1.016 pad 1.88 round: 2 2.54,0; 3 5.08,0; 4 7.62,0
LED-0603 = smd 0.8 x 0.8: A 0,-0.75; C 0,0.75
TACTILE_SWITCH_SMD = smd 1.524 x 0.762: 1 -2.54,1.905; 2 2.54,1.905; 3 -2.54,-1.905; 4 2.54,-1.905
SJ_2S = smd 0.635 x 1.27: 1 -0.412,0; 2 0.412,0
SJ_3 = smd 0.635 x 1.27: 1 -0.889,0; 2 0,0; 3 0.889,0
SOT23-5 = smd 0.55 x 1.2: 1 -0.95,-1.3; 2 0,-1.3; 3 0.95,-1.3; 4 0.95,1.3; 5 -0.95,1.3
RESONATOR-SMD = smd 0.7 x 1.7: 1 -1.2,0; 2 0,0; 3 1.2,0
2X3-NS = drill 1.016 pad 1.88 square: 1 -2.54,-1.27 | drill 1.016 pad 1.88 octagon: 2 -2.54,1.27; 3 0,-1.27; 4 0,1.27; 5 2.54,-1.27; 6 2.54,1.27
STAND-OFF = hole 3.302: 0,0
SM06B-SRSS-TB = smd 0.6 x 1.55: 1 -2.5,2.975; 2 -1.5,2.975; 3 -0.5,2.975; 4 0.5,2.975; 5 1.5,2.975; 6 2.5,2.975 | smd 1.2 x 1.8: FIT@1 -3.8,-0.9; FIT@2 3.8,-0.9

### Placement (x,y rotation side)
C1  26.67,35.56 0 top
C2  59.69,21.59 0 top
C3  12.7,27.94 90 top
C4  25.4,26.67 270 top
C5  39.37,8.89 90 top
C6  39.37,31.75 90 top
C7  30.48,7.62 180 top
C8  30.48,12.7 0 top
C9  29.21,31.75 90 top
C10  30.48,10.16 0 top
D1  33.02,34.29 270 top
D3  19.05,3.81 0 top
F1  36.83,8.89 90 top
IC1  46.99,21.59 0 top
IC2  MEGA168/328  [TQFP32-08@1]  19.05,27.94 180 top
IC3  15.24,11.43 0 top
JP1  6.35,1.27 90 top
JP2  3.81,1.27 90 top
JP3  1.27,1.27 90 top
JP4  6.35,21.59 90 top
JP5  3.81,21.59 90 top
JP6  1.27,21.59 90 top
JP7  21.59,39.37 0 top
JP8  36.83,39.37 0 top
JP9  36.83,36.83 0 top
JP10  54.61,3.81 180 top
JP11  54.61,1.27 180 top
JP12  67.31,31.75 270 top
JP13  67.31,11.43 180 top
JP14  67.31,39.37 270 top
JP15  36.83,3.81 180 top
JP16  55.88,31.75 0 top
JP17  11.43,1.27 0 top
JP18  36.83,1.27 180 top
JP19  57.15,1.27 90 top
JP20  22.23,8 0 top
LED1  12.7,24.13 0 top
LED2  19.05,38.1 90 top
LED3  11.43,27.94 0 top
R1  57.15,36.83 90 top
R2  17.78,21.59 180 top
R3  11.43,17.78 180 top
R4  19.05,36.83 180 top
R5  13.97,21.59 0 top
R6  26.67,34.29 180 top
R7  31.75,21.59 0 top
R8  38.1,30.48 270 top
R10  11.43,24.13 270 top
R11  31.75,20.32 0 top
R12  31.75,19.05 0 top
R13  31.75,17.78 0 top
R14  16.51,16.51 180 top
R15  21.59,15.24 180 top
R16  17.78,6.35 0 top
R17  13.97,6.35 0 top
R18  8.89,21.59 270 top
R19  8.89,24.13 270 top
R20  8.89,26.54 270 top
R21  25.4,22.86 90 top
R22  8.89,29.21 270 top
R23  22.86,34.29 180 top
R24  22.86,35.56 180 top
R25  22.86,36.83 180 top
S1  30.48,25.4 180 top
SJ1  12.32,3.81 0 top
SJ2  60.96,25.65 270 top
U1  26.67,11.43 0 top
U$1  44.45,8.89 0 top
U$4  13.97,38.1 0 top
U$5  60.96,36.83 270 top
U$6  [UAV_LOGO_SMALL_2]  14.48,21.08 90 bottom
U$7  19.56,12.45 90 bottom
U$8  0,-10.16 0 top  (outside the outline)
U$10  60.2,29.46 0 top
U$11  25.4,30.48 90 top
U$12  11.43,32.77 0 top
U$13  60.2,12.19 0 top
X2  66.04,5.08 90 top

### Tracks (layer width: path | path; a pad name or v marks a point on that pad's centre or on a via)
5V
  Top 0.254: 3.81,2.54 7.37,2.54 8.64,3.81 7.37,5.08 5.08,5.08 JP2.2
  Top 0.305: 8.64,3.81 SJ1.1
  Top 0.813: JP5.1 JP5.2 | JP2.1 3.81,2.54 JP2.2 | JP2.8 JP2.7 JP2.6 JP2.5 | JP5.5 JP5.6
  Bottom 0.813: JP5.4 JP5.5 | JP2.4 JP2.5 | JP2.8 JP5.1
  Bottom 1.016: JP5.2 JP5.3 JP5.4 | JP5.8 JP5.7 JP5.6 | JP2.4 JP2.3 JP2.2
#RST
  Top 0.254: JP7.1 22.86,38.1 24.64,38.1 25.65,37.08 25.65,36.96 26.02,36.59 C1.1
AREF  (via drill 0.51)
  Top 0.254: IC1.98 41.99,28.37 v42.67,27.69
  Bottom 0.254: v42.67,27.69 42.16,27.18 36.83,27.18 35.81,28.19 34.8,28.19 34.04,27.43 34.04,24.89 27.18,18.03 27.18,6.1 26.67,5.59 23.88,5.59 22.86,4.57 22.86,2.54 JP18.6
GND  (via drill 0.51)
  Top 0.254: 41.15,30.99 41.49,30.65 IC1.99 41.49,28.07 | IC1.11 41.39,22.59 41.4,22.61 | 43.99,15.62 IC1.32 43.99,11.48 42.04,9.53 | IC1.81 50.49,28.14 50.04,27.69 v49.02,27.69 | 53.09,21.84 53.85,21.08 IC1.62 56.65,21.09 57.28,21.72 | 1.27,10.16 7.37,10.16 7.62,9.91 7.62,9.27 8.38,8.51 | 1.27,38.1 7.87,38.1 | 1.27,35.56 7.87,35.56 | 1.27,27.94 7.87,27.94 | 1.27,7.62 7.87,7.62 | 33.02,2.54 33.02,4.83 | 35.56,2.54 35.56,4.83 | 38.1,2.54 38.1,4.83 | 38.1,2.54 40.64,2.54 40.64,4.83 | 35.56,2.54 38.1,2.54 | 33.02,2.54 35.56,2.54 | 25.4,2.54 25.4,4.95 | 27.94,2.54 27.94,4.83 | 30.48,2.54 30.48,4.83 | 23.75,2.54 25.4,2.54 | 25.4,2.54 27.94,2.54 | 27.94,2.54 30.48,2.54 | 30.48,2.54 33.02,2.54
  Top 0.813: 40.64,2.54 JP11.6
  Top 1.016: JP3.1 1.27,7.62 JP6.8
  Bottom 0.254: 1.27,12.7 8.89,12.7 | 1.27,15.24 8.38,15.24 | 1.27,17.78 8.64,17.78 | 1.27,33.02 8.64,33.02 | 45.72,2.54 45.72,5.08 | 40.64,2.54 40.64,5.08
  Bottom 0.406: JP3.7 1.27,17.78 | 8.64,33.02 8.64,33.27 | JP6.5 1.27,33.02 | JP11.6 40.64,2.54
  other vias: 28.07,31.75 42.42,23.37 45.72,16.76 20.83,9.65 17.27,26.92 25.27,24.89 44.4,7.24 35.31,27.18 62.53,21.49 34.16,30.23 13.21,12.19 12.7,26.16 38.48,5.71 38.05,11.94 11.94,16.51 8.38,33.15 24.89,11.43 26.29,8.76
  pour Top (isolate 0.305): 0,40.64 68.58,40.64 68.58,0 0,0
  pour Bottom (isolate 0.305): 0,40.64 68.58,40.64 68.58,0 0,0
IN0  (via drill 0.51)
  Top 0.254: IC3.2 12.06,9.78 v12.45,10.16 | IC2.30 20.25,21.91 v20.32,21.84 19.18,20.7 9.13,20.7 R18.2
  Bottom 0.254: v12.45,10.16 13.97,11.68 16.26,11.68 20.07,15.49 20.07,19.81 20.32,20.07 v20.32,21.84
IN1  (via drill 0.51)
  Top 0.254: IC2.31 21.05,22.77 v21.59,22.23 | IC3.5 15.88,6.73 v15.75,6.6 | v10.16,21.97 10.16,22.86 9.53,23.5 8.9,23.5 R19.2
  Bottom 0.254: v15.75,6.6 15.75,10.41 20.57,15.24 20.57,19.56 21.59,20.57 v21.59,22.23 21.08,22.73 10.92,22.73 v10.16,21.97
IN2  (via drill 0.51)
  Top 0.254: IC2.32 21.85,23.49 v22.86,22.48 | IC3.11 17.14,13.08 17.53,12.7 v19.56,12.7 | v7.62,25.4 8.13,25.91 8.88,25.91 R20.2
  Bottom 0.254: v19.56,12.7 19.56,13.46 21.08,14.99 21.08,19.3 22.86,21.08 v22.86,22.48 22.1,23.24 9.91,23.24 9.53,23.62 v7.62,25.4
IN3  (via drill 0.51)
  Top 0.254: IC3.14 13.34,16.26 14.86,17.78 v21.97,17.78 | R21.2 23.23,23.51 v22.99,23.75 23.34,24.11 IC2.1
  Bottom 0.254: v21.97,17.78 21.97,19.43 23.75,21.21 23.75,22.99 v22.99,23.75
IN4  (via drill 0.51)
  Top 0.254: IC2.2 21.5,25.94 v20.83,25.27 | v7.49,30.48 7.49,30.1 8,29.59 8,28.96 8.38,28.57 9,28.57 R22.2
  Bottom 0.254: v20.83,25.27 19.81,24.26 10.41,24.26 9.14,25.53 9.14,27.18 8.38,27.94 8.38,29.59 v7.49,30.48
IN5
  Top 0.254: IC2.9 21.85,33.93 R23.2
IN6
  Top 0.254: IC2.10 21.05,35.15 21.46,35.56 R24.2
IN7
  Top 0.254: R25.2 21.08,36.83 20.25,36 IC2.11
MUX  (via drill 0.51)
  Top 0.254: IC2.13 18.65,31.13 v20.07,29.72 | v11.43,21.59 R10.2 10.94,23.48 10.54,23.88 v10.54,29.72 | IC3.1 10.71,8.27 | IC3.1 10.79,8.26 | IC3.1 9.42,8.36 8.13,9.65 8.13,14.22 8.64,14.73 8.64,16.51 9.27,17.14 9.27,17.53 v9.65,17.78 R3.2 10.65,17.91 | R8.1 38.1,32.13 v37.97,32.26
  Bottom 0.254: v20.07,29.72 19.05,28.7 18.54,28.7 | 18.54,28.7 11.56,28.7 v10.54,29.72 | v9.65,17.78 10.79,17.91 11.43,18.54 v11.43,21.59 | 18.54,28.7 18.54,27.18 18.92,26.8 19.81,26.8 20.19,27.18 27.43,27.18 32.89,32.64 37.59,32.64 v37.97,32.26
N$1
  Top 0.254: LED1.A 12.7,22.35 13.46,21.59 R5.1
N$2
  Top 0.254: R4.1 19.7,38 LED2.A
N$3
  Top 0.254: U1.4 28.29,12.73 29.84,11.18 29.84,10.18 C10.1
N$5
  Top 0.254: R10.1 LED3.A
N$6
  Top 0.254: IC2.7 24.16,29.94 24.89,29.21 25.33,29.21 U$11.1
N$7
  Top 0.254: IC2.8 23.6,30.96 24.38,31.75 25.33,31.75 U$11.3
N$8
  Top 0.254: JP1.5 7.62,12.7 7.62,14.48 8.13,14.99 8.13,16.76 8.76,17.4 8.76,18.41 9.02,18.67 22.61,18.67 23.88,17.4 30.23,17.4 30.61,17.78 R13.1
N$9
  Top 0.254: JP1.6 7.62,15.24 7.62,17.02 8.26,17.65 8.26,18.8 8.64,19.18 22.86,19.18 24.13,17.91 29.84,17.91 30.97,19.04 R12.1
N$10
  Top 0.254: JP1.7 7.75,17.91 7.75,19.05 8.38,19.68 23.11,19.68 24.38,18.41 29.59,18.41 30.23,19.05 30.23,19.81 30.72,20.3 R11.1
N$11
  Top 0.254: JP1.8 7.49,20.19 23.37,20.19 24.64,18.92 29.34,18.92 29.59,19.18 29.59,20.07 30.35,20.83 30.35,20.84 R7.1
N$12
  Top 0.254: JP14.1 65.53,37.59 65.53,34.04 63.5,32 63.5,26.16 62.99,25.65 SJ2.2
N$13  (via drill 0.51)
  Top 0.254: R14.1 18.03,16.51 v18.29,16.76
  Bottom 0.254: JP1.4 9.65,9.02 10.29,9.65 10.29,10.29 11.94,11.94 11.94,12.83 13.46,14.35 13.46,15.75 14.48,16.76 v18.29,16.76
N$14  (via drill 0.51)
  Top 0.254: R15.1 22.99,15.24 23.24,15.49 v23.24,16
  Bottom 0.254: JP1.3 7.37,7.37 10.03,7.37 12.83,4.7 12.83,4.06 13.34,3.56 14.1,3.56 16.64,6.1 16.64,7.11 16.26,7.49 16.26,10.16 17.91,11.81 20.07,11.81 20.45,12.19 20.45,13.59 21.97,15.11 22.35,15.11 v23.24,16
N$15  (via drill 0.51)
  Top 0.254: R16.1 16.89,6.35 16.89,6.22 16.38,5.71 15.75,5.71 15.49,5.46 10.79,5.46 v10.54,5.21
  Bottom 0.254: v10.54,5.21 9.4,6.35 8.64,6.35 8,5.71 8,5.46 JP1.2
N$16  (via drill 0.51)
  Top 0.254: R17.1 10.03,6.35 v9.02,5.33
  Bottom 0.254: v9.02,5.33 9.02,2.29 8,1.27 JP1.1
N$17
  Top 0.305: SJ1.2 D3.A
N$18
  Top 0.254: JP4.1 7.37,21.59 8,22.23 8.88,22.23 R18.1
N$19
  Top 0.254: R19.1 8.27,24.78 7.62,24.13 JP4.2
N$20
  Top 0.254: R20.1 8.52,27.19 8,26.67 JP4.3
N$21  (via drill 0.51)
  Top 0.254: R21.1 25.4,21.34 v25.65,21.08
  Bottom 0.254: v25.65,21.08 25.65,23.11 24.13,24.64 22.48,24.64 21.59,23.75 10.16,23.75 8.64,25.27 8.64,26.92 JP4.4
N$22
  Top 0.254: R22.1 8.89,30.48 7.62,31.75 JP4.5
N$23  (via drill 0.51)
  Top 0.254: R23.1 23.51,33.29 v23.24,33.02
  Bottom 0.254: JP4.6 7.11,35.05 21.21,35.05 v23.24,33.02
N$24  (via drill 0.51)
  Top 0.254: R24.1 24.13,35.56 v24.64,35.05
  Bottom 0.254: JP4.7 7.62,35.56 23.88,35.56 24.38,35.05 v24.64,35.05
N$25  (via drill 0.51)
  Top 0.254: v24.64,36.83 R25.1
  Bottom 0.254: JP4.8 7.62,38.1 17.4,38.1 18.67,36.58 24.38,36.58 v24.64,36.83
N$26  (via drill 0.51)
  Top 0.406: F1.1 35.56,6.22 28.19,6.22 27.81,6.6 v25.4,6.6 | D3.C 21.2,4.94 v22.1,5.84
  Bottom 0.406: v22.1,5.84 23.11,5.84 23.88,6.6 v25.4,6.6
N$27
  Top 0.254: JP7.4 29.21,37.85 29.59,37.47 30.35,37.47 31.37,36.45 D1.A
N$56
  Top 0.254: IC1.34 44.99,11.27 45.59,10.67 45.59,8.95 U$1.3
N$89
  Top 0.254: IC1.33 44.49,11.22 43.31,10.03 43.31,8.95 U$1.1
OUT0
  Top 0.254: IC3.4 14.61,6.37 R17.2
OUT1
  Top 0.254: IC3.7 18.41,6.37 R16.2
OUT2
  Top 0.254: 19.81,14.63 IC3.9 19.68,15.24 R15.2
OUT3
  Top 0.254: IC3.12 15.88,16.5 R14.2
PA6  (via drill 0.51)
  Top 0.254: IC1.72 56.57,26.09 57.15,26.67 57.15,28.19 v57.4,28.45
  Bottom 0.254: v57.4,28.45 57.15,28.19 57.15,14.22 46.99,4.06 JP10.4
PA7  (via drill 0.51)
  Top 0.254: IC1.71 57.34,25.59 58.17,26.42 v58.17,27.43
  Bottom 0.254: v58.17,27.43 58.17,26.92 57.66,26.42 57.66,13.97 48.26,4.57 48.26,2.54 JP11.3
PB0  (via drill 0.51)
  Top 0.254: IC1.19 37.77,18.59 37.47,18.29 v37.47,17.78
  Bottom 0.254: JP15.2 34.29,4.32 33.02,5.59 31.75,5.59 31.24,6.1 31.24,16 33.02,17.78 v37.47,17.78
PB1  (via drill 0.51)
  Top 0.254: v42.67,21.59 41.4,20.32 41.4,19.3 40.19,18.09 IC1.20
  Bottom 0.254: U$5.3 59.18,36.83 53.59,31.24 53.59,21.08 52.83,20.32 43.94,20.32 v42.67,21.59
PB2  (via drill 0.51)
  Top 0.254: v42.67,19.81 40.45,17.59 IC1.21
  Bottom 0.254: U$5.4 60.96,35.56 58.67,35.56 54.1,30.99 54.1,20.83 53.09,19.81 v42.67,19.81
PB3  (via drill 0.51)
  Top 0.254: v43.94,23.11 43.94,19.56 43.18,18.8 42.42,18.8 40.71,17.09 IC1.22
  Bottom 0.254: U$5.1 58.17,37.85 58.17,36.58 53.09,31.5 53.09,21.34 52.58,20.83 44.45,20.83 43.94,21.34 v43.94,23.11
PB4  (via drill 0.51)
  Top 0.254: IC1.23 41.48,16.59 v41.78,16.64
  Bottom 0.254: JP18.1 35.56,2.54 35.56,4.57 34.04,6.1 32,6.1 31.75,6.35 31.75,15.75 33.27,17.27 36.7,17.27 37.21,16.76 41.66,16.76 v41.78,16.64
PB5  (via drill 0.51)
  Top 0.254: IC1.24 40.04,16.09 40.64,15.49 v41.02,15.49
  Bottom 0.254: JP15.1 36.58,4.06 36.58,4.32 34.29,6.6 32.51,6.6 32.26,6.86 32.26,15.49 33.53,16.76 36.45,16.76 36.96,16.26 40.13,16.26 v41.02,15.49
PB6
  Top 0.254: 18.29,14.63 IC3.10 18.41,15.49 19.81,16.89 36.7,16.89 38,15.59 IC1.25
PB7
  Top 0.254: 14.48,14.38 IC3.13 14.61,12.57 15.49,11.68 20.07,11.68 20.57,12.19 20.57,13.84 21.08,14.35 22.86,14.35 24.89,16.38 36.45,16.38 37.85,14.99 40.13,14.99 40.99,14.13 IC1.26
PC0
  Top 0.254: JP12.8 64.69,16.59 IC1.53
PC1
  Top 0.254: JP12.7 66.73,17.09 IC1.54
PC2
  Top 0.254: JP12.6 67.06,19.05 65.6,17.59 IC1.55
PC3
  Top 0.254: JP12.5 66.04,20.32 66.04,18.8 65.53,18.29 65.33,18.09 IC1.56
PC4
  Top 0.254: JP12.4 65.53,22.35 65.53,19.05 65.07,18.59 IC1.57
PC5
  Top 0.254: JP12.3 66.04,25.4 66.04,23.62 65.02,22.61 65.02,19.56 64.77,19.3 64.56,19.09 IC1.58
PC6
  Top 0.254: JP12.2 65.53,27.43 65.53,23.88 64.52,22.86 64.52,20.07 64.04,19.59 IC1.59
PC7
  Top 0.254: JP12.1 65.02,29.46 65.02,24.13 64.01,23.11 64.01,20.57 63.52,20.09 IC1.60
PD0
  Top 0.254: IC1.43 49.49,11.72 50.93,10.29 50.93,5.97 51.94,4.95 51.94,3.94 JP10.2
PD1
  Top 0.254: JP11.1 53.34,2.54 53.34,4.57 52.7,5.21 52.45,5.21 51.44,6.22 51.44,10.54 49.99,11.99 IC1.44
PD2
  Top 0.254: 62.8,4.57 X2.3 63.31,4.57 61.98,4.57 61.21,3.81 JP19.2 56.52,4.45 55.88,4.45 55.24,5.08 54.48,5.08 53.85,5.71 52.7,5.71 51.94,6.48 51.94,10.79 50.49,12.25 IC1.45
PD3  (via drill 0.51)
  Top 0.254: X2.4 62.8,5.59 | X2.4 63.33,5.59 | X2.4 63.31,5.59 61.47,5.59 v60.96,5.08 56.52,5.08 56.01,5.59 54.74,5.59 54.1,6.22 52.96,6.22 52.45,6.73 52.45,11.05 50.99,12.51 IC1.46
  Bottom 0.254: JP19.1 59.69,1.27 60.96,2.54 v60.96,5.08
PD4  (via drill 0.51)
  Top 0.254: IC1.47 51.49,12.77 53.09,11.18 53.09,7.37 v53.34,7.11
  Bottom 0.254: v53.34,7.11 53.34,5.08 JP10.1
PE0
  Top 0.254: IC1.2 37.43,27.09 37.08,27.43 37.08,29.72 36.7,30.1 36.7,32.51 34.54,34.67 32.38,34.67 30.1,36.96 27.3,36.96 26.67,37.59 JP7.3
PE1
  Top 0.254: JP7.2 27.05,36.45 29.84,36.45 32.13,34.16 34.29,34.16 36.2,32.26 36.2,29.84 36.58,29.46 36.58,27.18 37.16,26.59 IC1.3
PE3  (via drill 0.51)
  Top 0.254: IC1.5 35.62,25.59 v35.56,25.65
  Bottom 0.254: v35.56,25.65 27.69,17.78 27.69,5.84 26.92,5.08 25.91,5.08 25.4,4.57 25.4,2.54 JP18.5
PE4
  Top 0.254: IC1.6 36.65,25.09 35.18,23.62 35.05,23.62 34.04,22.61 34.04,22.23 33.4,21.59 R7.2
PE5
  Top 0.254: IC1.7 37.04,24.59 35.43,22.99 35.18,22.99 34.54,22.35 34.54,21.97 32.89,20.32 R11.2
PE6  (via drill 0.51)
  Top 0.254: v40.89,25.65 40.89,24.38 40.6,24.09 IC1.8
  Bottom 0.254: JP11.7 38.1,2.54 38.1,4.57 37.59,5.08 36.58,5.08 34.54,7.11 33.02,7.11 32.77,7.37 32.77,15.24 33.78,16.26 36.2,16.26 36.7,15.75 39.5,15.75 40.64,14.61 41.78,14.61 42.67,15.49 42.67,17.02 40.39,19.3 40.39,25.15 v40.89,25.65
PE7  (via drill 0.51)
  Top 0.254: IC1.9 37.37,23.59 v37.34,23.62
  Bottom 0.254: v37.34,23.62 34.29,23.62 28.19,17.53 28.19,5.59 26.67,4.06 JP15.5
PF0
  Top 0.254: JP8.1 35.31,37.85 35.31,35.81 35.81,35.31 37.34,35.31 38.1,34.54 38.86,34.54 42.49,30.92 IC1.97
PF1
  Top 0.254: JP9.1 37.59,36.07 37.59,35.81 38.35,35.05 39.12,35.05 42.99,31.18 IC1.96
PF2
  Top 0.254: JP8.2 38.1,38.1 38.1,36.07 38.61,35.56 39.37,35.56 43.49,31.44 IC1.95
PF3
  Top 0.254: 39.37,36.58 JP9.2 39.37,36.32 43.99,31.7 IC1.94
PF4
  Top 0.254: IC1.93 44.49,31.96 40.64,35.81 40.64,38.1 JP8.3
PF5
  Top 0.254: IC1.92 44.99,32.23 41.91,35.31 JP9.3
PF6
  Top 0.254: IC1.91 45.49,32.49 43.18,34.8 43.18,38.1 JP8.4
PF7
  Top 0.254: IC1.90 45.99,32.75 44.45,34.29 JP9.4
PG0
  Top 0.254: 64.77,12.45 JP13.2 64.77,14.22 63.75,15.24 63.4,15.59 IC1.51
PG1
  Top 0.254: JP13.1 65.79,12.95 65.79,14.48 64.17,16.09 IC1.52
PG2
  Top 0.254: IC1.70 57.46,25.09 57.66,24.89 59.44,24.89 59.69,25.15 59.69,26.16 60.2,26.67 60.83,26.67 SJ2.1
PG5
  Top 0.254: IC1.1 38.45,27.59 38.1,27.94 R8.2
PH0  (via drill 0.51)
  Top 0.254: IC1.12 37.22,22.09 v36.83,22.48
  Bottom 0.254: v36.83,22.48 36.07,23.11 34.54,23.11 28.7,17.27 28.7,5.46 27.94,4.57 27.94,2.54 JP18.4
PH1  (via drill 0.51)
  Top 0.254: v35.56,22.1 36.07,21.59 IC1.13
  Bottom 0.254: v35.56,22.1 34.29,22.1 29.21,17.02 JP15.4
PH2  (via drill 0.51)
  Top 0.254: v34.8,20.95 34.92,21.09 IC1.14
  Bottom 0.254: JP18.3 30.48,2.54 30.48,4.57 29.72,5.33 29.72,16.76 33.91,20.95 v34.8,20.95
PH3  (via drill 0.51)
  Top 0.254: v34.29,19.81 34.92,19.81 35.7,20.59 IC1.15
  Bottom 0.254: JP15.3 31.75,4.06 30.23,5.59 30.23,16.51 33.53,19.81 v34.29,19.81
PH4
  Top 0.254: IC1.16 35.97,20.09 34.8,18.92 32.53,18.92 R12.2
PH5
  Top 0.254: IC1.17 36.23,19.59 35.05,18.41 33.66,18.41 33.02,17.78 R13.2
PH6  (via drill 0.51)
  Top 0.254: IC1.18 37,19.09 v36.58,18.67
  Bottom 0.254: JP18.2 33.02,2.54 33.02,4.57 32.51,5.08 31.5,5.08 30.73,5.84 30.73,16.26 33.15,18.67 v36.58,18.67
PJ0
  Top 0.254: JP14.3 64.52,31.5 64.52,24.38 63.5,23.37 58.17,23.37 56.39,21.59 IC1.63
PJ1
  Top 0.254: JP14.2 66.04,35.56 66.04,33.78 64.01,31.75 64.01,24.64 63.25,23.88 57.91,23.88 56.13,22.09 IC1.64
PJ2
  Top 0.254: IC1.65 55.86,22.59 57.66,24.38 60.58,24.38 SJ2.3
PK0
  Top 0.254: IC1.89 46.49,33.01 45.72,33.78 45.72,38.1 JP8.5
PK1
  Top 0.254: IC1.88 JP9.5
PK2
  Top 0.254: IC1.87 47.49,33.01 48.26,33.78 48.26,38.1 JP8.6
PK3
  Top 0.254: IC1.86 47.99,32.75 49.53,34.29 JP9.6
PK4
  Top 0.254: IC1.85 48.49,32.49 50.8,34.8 50.8,38.1 JP8.7
PK5
  Top 0.254: IC1.84 48.99,32.23 52.07,35.31 JP9.7
PK6
  Top 0.254: IC1.83 49.49,31.96 53.34,35.81 53.34,38.1 JP8.8
PK7
  Top 0.254: IC1.82 49.99,31.7 54.61,36.32 JP9.8
PL0  (via drill 0.51)
  Top 0.254: v46.99,24.64 46.99,16.26 45.49,14.76 IC1.35 45.49,11.79 46.48,10.79 46.48,10.16 47.88,8.76 47.88,6.48 47.5,6.1 43.94,6.1 42.16,4.32 42.16,4.06 JP10.6 | 27.3,34.42 R6.1 27.56,34.29 28.32,35.05 29.72,35.05 30.73,34.04 30.73,33.53 v30.99,33.27
  Bottom 0.254: v46.99,24.64 46.99,32 45.85,33.15 31.11,33.15 v30.99,33.27
PL1
  Top 0.254: JP11.5 43.18,2.54 43.18,4.57 44.2,5.59 47.75,5.59 48.39,6.22 48.39,9.02 46.99,10.41 46.99,11.05 45.99,12.05 IC1.36
PL2
  Top 0.254: JP10.5 45.72,5.08 48.01,5.08 48.9,5.97 48.9,9.27 47.5,10.67 47.5,11.43 46.49,12.44 IC1.37
PL3
  Top 0.254: JP11.4 48.26,2.54 48.26,4.57 49.4,5.71 49.4,9.53 48.01,10.92 48.01,11.68 46.99,12.7 IC1.38
PL4  (via drill 0.51)
  Top 0.254: IC1.39 47.49,15.74 v48.26,16.51 | v38.61,13.97 38.1,14.48 37.59,14.48 36.2,15.88 25.15,15.88 23.11,13.84 21.46,13.84 21.08,13.46 21.08,11.94 20.32,11.18 13.97,11.18 13.34,10.54 IC3.3
  Bottom 0.254: v38.61,13.97 38.99,13.97 39.24,14.22 40.26,14.22 40.51,13.97 41.91,13.97 42.29,14.35 46.1,14.35 v48.26,16.51
PL5  (via drill 0.51)
  Top 0.254: IC1.40 47.99,14.97 v49.53,16.51 | v39.88,13.34 39.5,12.95 38.35,12.95 35.94,15.37 25.4,15.37 23.37,13.34 21.84,13.34 21.59,13.08 21.59,11.68 20.57,10.67 17.53,10.67 17.14,10.29 IC3.6
  Bottom 0.254: v39.88,13.34 40.39,13.34 40.51,13.46 42.16,13.46 42.55,13.84 46.86,13.84 v49.53,16.51
PL6
  Top 0.254: IC1.41 48.49,11.2 49.91,9.78 49.91,4.19 JP10.3
PL7
  Top 0.254: JP11.2 50.8,2.54 50.8,5.33 50.42,5.71 50.42,10.03 48.99,11.46 IC1.42
PPM  (via drill 0.51)
  Top 0.254: v25.53,33.02 26.04,33.53 26.04,34.27 R6.2 | IC2.14 17.85,33.73 v17.91,33.78
  Bottom 0.254: v17.91,33.78 20.45,31.24 24.77,31.24 25.53,31.88 v25.53,33.02
PPM_LED
  Top 0.254: IC2.12 19.45,34.78 18.41,35.81 18.41,36.81 R4.2
PPM_MISO
  Top 0.254: U$4.1 11.94,36.32 12.57,36.32 16.25,32.65 IC2.16
PPM_MOSI
  Top 0.254: U$4.4 15.24,38.1 15.24,34.8 17.05,32.99 IC2.15
PPM_RST  (via drill 0.51)
  Top 0.254: v19.43,27.69 19.45,25.8 IC2.29 19.45,22.24 18.8,21.59 R2.1
  Bottom 0.254: v19.43,27.69 24.38,27.69 27.05,30.35 27.05,32 27.56,32.51 27.56,35.43 27.05,35.94 24.26,35.94 24.13,36.07 17.27,36.07 U$4.5
PPM_SCK
  Top 0.254: U$4.3 12.7,38.1 10.16,38.1 9.91,37.85 9.91,36.07 10.54,35.43 12.7,35.43 14.73,33.4 14.73,30.77 IC2.17
RST  (via drill 0.51)
  Top 0.254: IC1.30 42.99,17.08 v43.94,18.03 | R1.1 57.15,35.31 58.17,34.29 U$5.5 | C1.2 29.97,35.56 31.88,33.66 34.04,33.66 35.69,32 35.69,29.34 v35.56,29.21 33.66,27.3 S1.3
  Bottom 0.254: U$5.5 58.17,34.29 54.61,30.73 54.61,20.57 53.34,19.3 44.45,19.3 43.94,18.8 v43.94,18.03 42.42,18.03 40.89,19.56 40.89,24.38 43.94,27.43 43.94,27.94 43.18,28.7 42.16,28.7 41.15,27.69 37.08,27.69 v35.56,29.21
VCC  (via drill 0.51)
  Top 0.254: 21.59,28.63 19.88,28.63 18.57,29.94 IC2.18 13.75,29.94 13.72,29.97 | 21.59,28.63 21.59,27.94 21.99,27.54 IC2.4 24.4,27.54 24.62,27.32 C4.1 26.05,27.32 26.92,28.19 30.99,28.19 33.02,30.23 D1.C | 53.09,20.57 50.99,22.67 50.99,26.61 | 53.09,20.57 53.96,20.57 IC1.61 57.04,20.59 58.04,21.59 C2.1 | 41.91,25.4 41.91,24.64 40.36,23.09 IC1.10 | 23.41,29.21 IC2.6 22.1,29.14 21.59,28.63 | X2.5 62.79,6.6 60.96,6.6 60.71,6.35 JP19.3 | U$4.2 9.91,39.37 9.4,38.86 9.4,35.81 10.29,34.92 12.45,34.92 13.72,33.66 13.72,29.97 | JP19.3 58.17,6.35 | 13.72,27.18 13.1,27.18 C3.1 | 41.91,25.4 41.91,26.16 40.99,27.08 IC1.100 | 13.72,27.18 13.72,29.97 | 50.99,26.61 IC1.80 50.99,31.94 54.61,35.56 55.63,35.56 56.13,36.07 56.13,37.08 56.53,37.48 R1.2 57.55,37.48 58.17,38.1 60.96,38.1 U$5.2 | R2.2 v15.88,21.59 R5.2 14.62,23.48 13.72,24.38 13.72,27.18 | 50.99,26.61 50.93,26.67 45.72,26.67 44.96,25.91 44.96,25.4 | 44.96,25.4 44.96,17.53 43.49,16.06 IC1.31 43.49,11.87 41.91,10.29 C5.A | 41.91,25.4 44.96,25.4 | IC1.100 | 53.09,20.57 53.09,14.99 53.59,14.48 53.59,8.13 55.37,6.35 JP19.3 | C9.A 29.71,33.15 30.48,32.38 33.02,32.38 D1.C | C6.1 39.37,29.59 v39.62,29.34 39.88,29.59 IC1.100 | IC3.16 10.79,13.21 v10.29,12.7 | F1.2 35.31,11.81 30.1,11.81 29.83,12.08 C8.1 29.21,12.7 28.19,13.72 26.16,13.72 25.72,13.27 U1.5 | v34.54,31.62 33.54,31.62 D1.C
  Top 0.305: F1.2 C5.A 39.49,10.29 41.27,8.51 41.27,6.35 39.62,4.7 39.62,4.06 JP10.7
  Top 0.406: C5.A
  Bottom 0.254: v34.54,31.62 35.69,31.62 37.21,30.1 37.21,29.84 37.72,29.34 v39.62,29.34 | v10.29,12.7 10.29,13.34 15.88,18.92 v15.88,21.59
VIN
  Top 0.254: C7.A 27.62,9.08 U1.3
  Top 0.406: 24.77,7.62 24.13,6.99 JP15.6 22.61,2.29 22.61,1.02 22.23,0.64 14.99,0.64 14.35,1.27 JP17.2 | 24.77,7.62 C7.A | 24.77,7.62 24.77,9.02 25.72,9.97 U1.1

### Text on the board
Bottom: Pris =)
tPlace: AT1280 SPI | PPM | GREEN | BLACK | FTDI | AT328 SPI | MUX | SJ2 | Inputs | Reset | PWR | - | + | S | ArduPilotMega | V1.4 | Outputs | SJ1 | GPS Port | - | +
bPlace: IN8 | G2 | DTR | TXO | RXI | +5V | CTS | GND | (39) | TX3 | IN7 | PF1(A1)/PF0(A0) | PF3(A3)/PF2(A2) | PF5(A5)/PF4(A4) | PK7(A7)/PF6(A6) | PK1(A9)/PK0(A8) | PK3(A11)/PK2(A10) | PK5(A13)/PK4(A12) | PK7(A15)/PK6(A14) | IN6 | RX3 | IN5 | PC7(30) | IN4 | PC6 | (31) | IN3 | MUX | PC5(32) | IN2 | PC4(33) | IN1 | PC3(34) | OUT8 | PC2(35) | OUT7 | PC1(36) | OUT6 | Arduino Compatible | PC0(37) | OUT5 | PG0(41) | PG1(40) | OUT4 | GND | +5V | OUT3 | MUX | AREF/VIN | PE3(5)/PE7 | RX2/TX2 | PH2/PH3(6) | PH6(9)/PB0(53) | PB4(10)/PB5(11) | PE6/+5V | GND/PL0(49) | PL1(48)/PL2(47) | PL3(46)/PA6(28) | PA7(29)/PL6(43) | PL7(42)/SCL | SDA/PD4 | RX1 | OUT2 | - | + | VIN: | +6V-12V | TX1 | OUT1
tNames: C. Anderson and J. Muñoz